# Altium schematic sheet ESP8266.SchDoc
size A3; Author: Bao Thuan; Organization: BACH-KHOA-DK
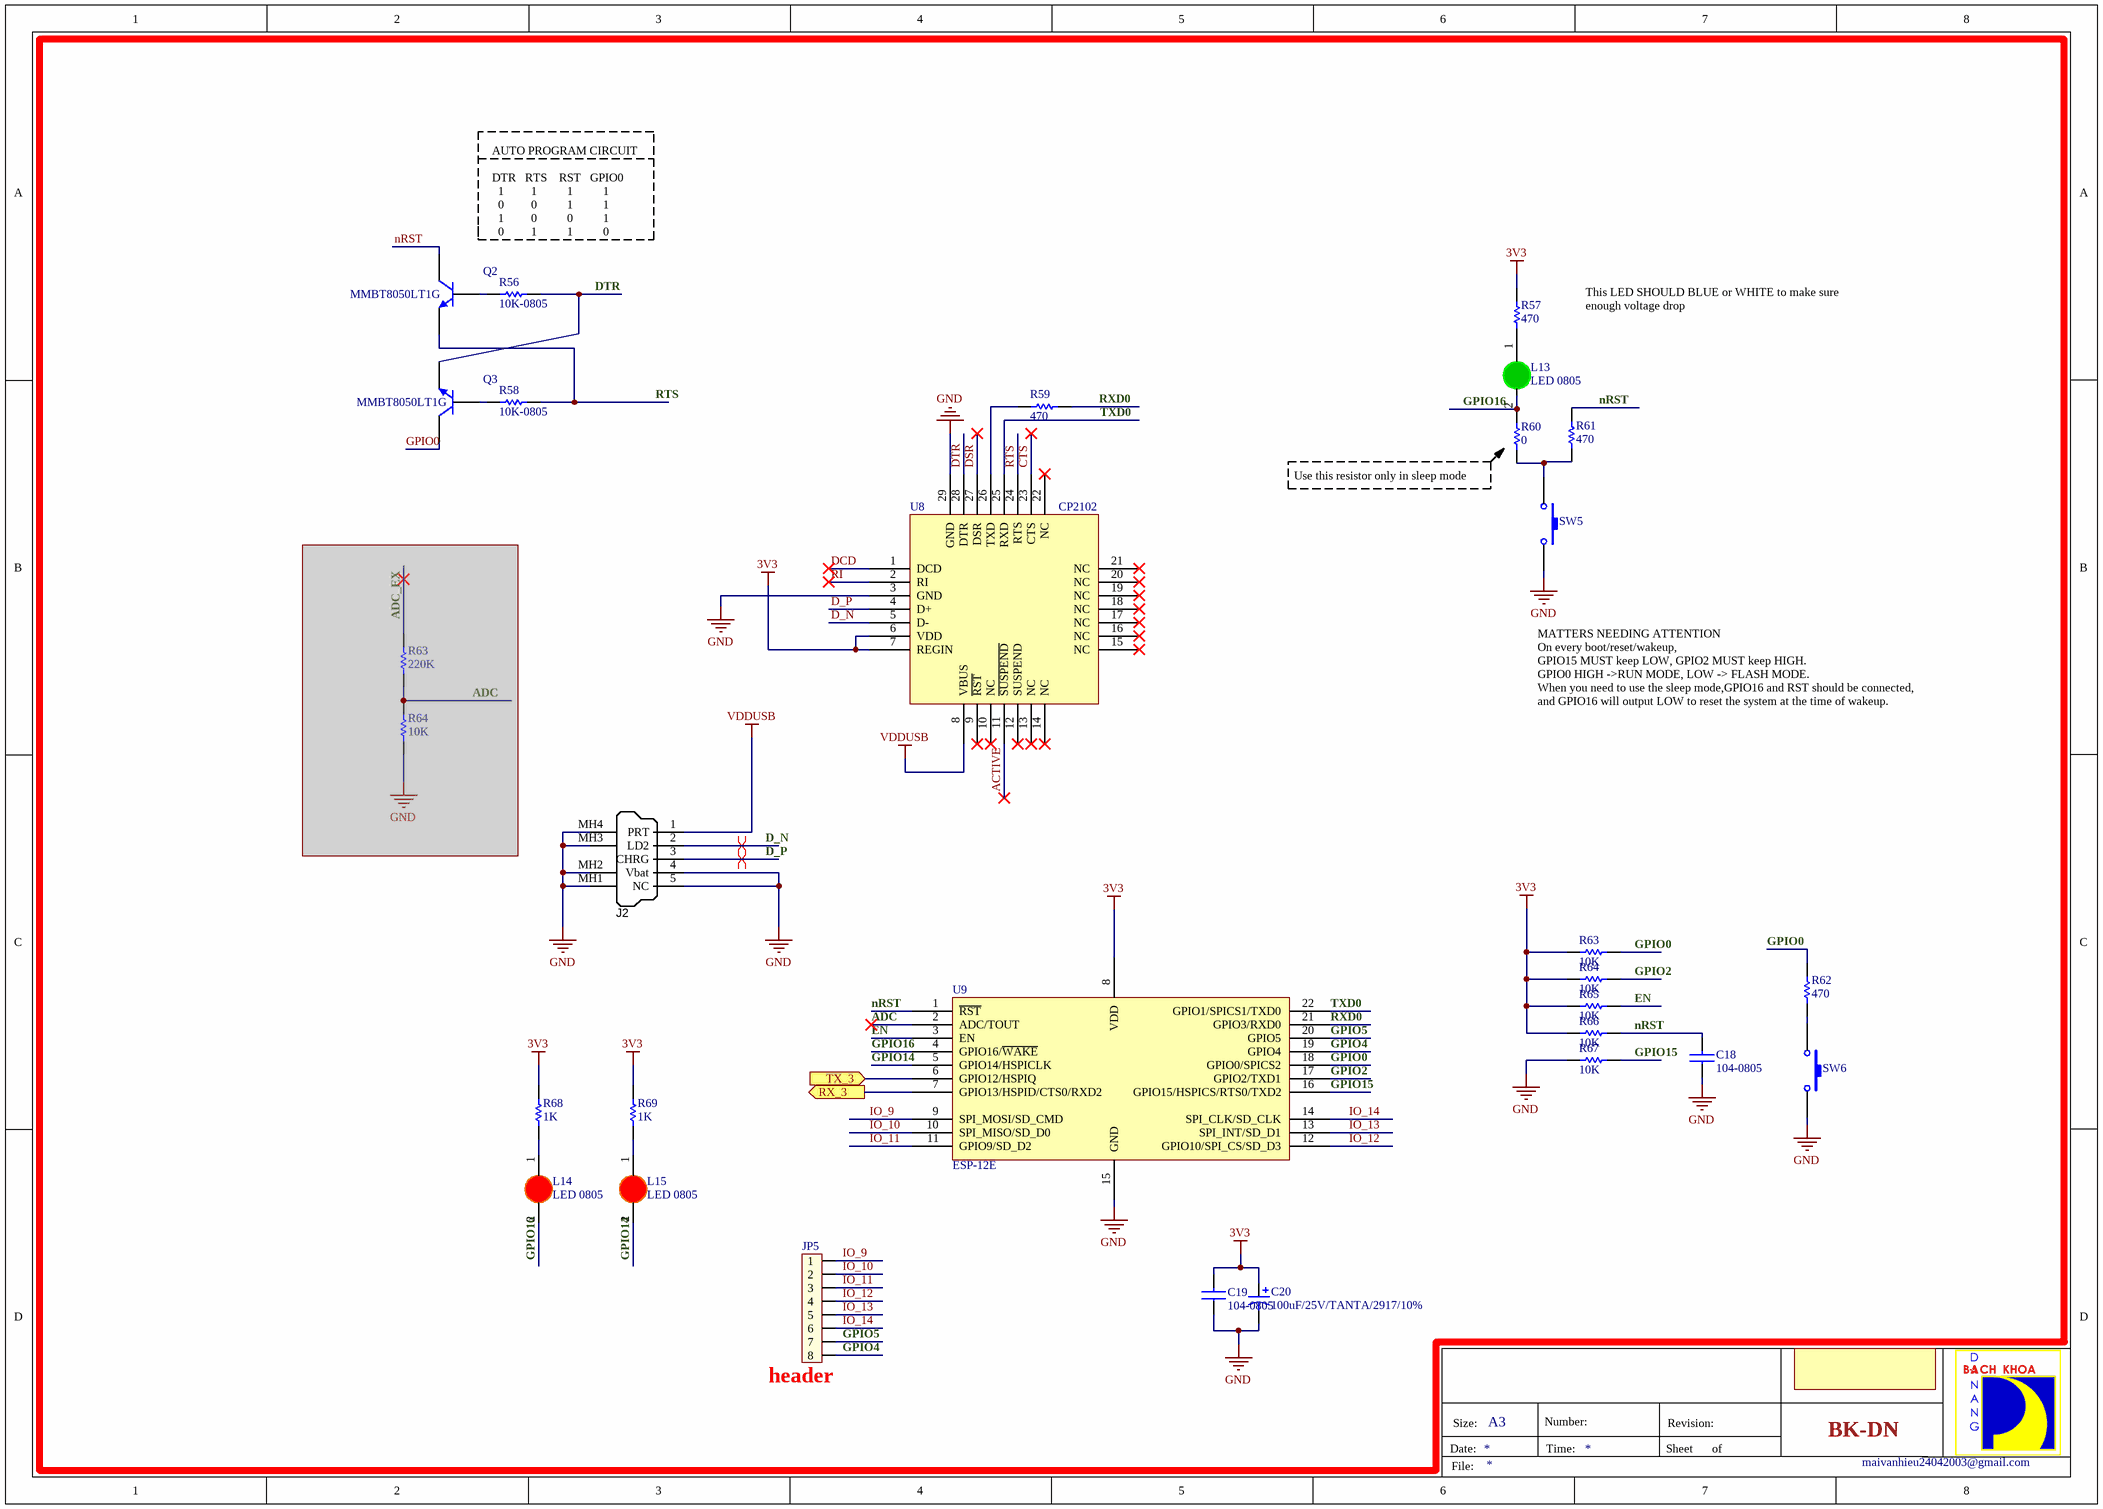
[diagram p0: ESP8266.SchDoc]

## Parts
(Parts that share a designator on the sheet are numbered #1, #2 ... from top to bottom, then left to right.)
C18  104-0805  [CAP0805]
C19  104-0805  [CAP0805]
C20  100uF/25V/TANTA/2917/10%  [CAP TANT CASE X SMD]
J2  USB_Mini-B  [USB_Mini-B_Molex_SMT]  (value not drawn)
JP5  header  [JP8]
L13  LED 0805  [LED-GREEN-0805]
L14  LED 0805  [LED-RED-0805]
L15  LED 0805  [LED-RED-0805]
Q2  MMBT8050LT1G  [SOT23]
Q3  MMBT8050LT1G  [SOT23]
R56  value 10K-0805  [RESC2012L]  (hidden comment: Resistor)
R57  value 470  [RESC2012L]  (hidden comment: Resistor)
R58  value 10K-0805  [RESC2012L]  (hidden comment: Resistor)
R59  value 470  [RESC2012L]  (hidden comment: Resistor)
R60  value 0  [RESC2012L]  (hidden comment: Resistor)
R61  value 470  [RESC2012L]  (hidden comment: Resistor)
R62  value 470  [RESC2012L]  (hidden comment: Resistor)
R63#1  value 220K  [RESC2012L]  (hidden comment: Resistor)  (masked out: inside a compile mask, not in the netlist)
R63#2  value 10K  [RESC2012L]  (hidden comment: Resistor)
R64#1  value 10K  [RESC2012L]  (hidden comment: Resistor)  (masked out: inside a compile mask, not in the netlist)
R64#2  value 10K  [RESC2012L]  (hidden comment: Resistor)
R65  value 10K  [RESC2012L]  (hidden comment: Resistor)
R66  value 10K  [RESC2012L]  (hidden comment: Resistor)
R67  value 10K  [RESC2012L]  (hidden comment: Resistor)
R68  value 1K  [RESC2012L]  (hidden comment: Resistor)
R69  value 1K  [RESC2012L]  (hidden comment: Resistor)
SW5  RS-282G05A3-SM RT  [SW_RS-282G05A3-SM RT]  (value not drawn)
SW6  RS-282G05A3-SM RT  [SW_RS-282G05A3-SM RT]  (value not drawn)
U8  CP2102  [CP2102]
U9  ESP-12E  [ESP-12E]

## Ports
RX_3 (out), TX_3 (in)

## Nets
3V3: C19.2 C20.1 R57.2 R63#2.1 R64#2.1 R65.1 R66.1 R68.2 R69.2 U8.6(VDD) U8.7(REGIN) U9.8(VDD)
GND: C18.1 C19.1 C20.2 J2.4(Vbat) J2.5(NC) J2.MH1(Shell) J2.MH2(Shell) J2.MH3(Shell) J2.MH4(Shell) R67.1 SW5.1 SW6.1 U8.3(GND) U8.29(GND) U9.15(GND)
VDDUSB: J2.1(PRT) U8.8(VBUS)
ACTIVE: U8.11(~{SUSPEND})
ADC: U9.2(ADC/TOUT)
CTS: U8.23(CTS)
D_N: J2.2(LD2) U8.5(D-)
D_P: J2.3(CHRG) U8.4(D+)
DCD: U8.1(DCD)
DSR: U8.27(DSR)
DTR: Q3.2(E) R56.2 U8.28(DTR)
EN: R65.2 U9.3(EN)
GPIO0: Q3.3(C) R62.2 R63#2.2 U9.18(GPIO0/SPICS2)
GPIO2: R64#2.2 U9.17(GPIO2/TXD1)
GPIO4: JP5.8 U9.19(GPIO4)
GPIO5: JP5.7 U9.20(GPIO5)
GPIO14: L15.2(K) U9.5(GPIO14/HSPICLK)
GPIO15: R67.2 U9.16(GPIO15/HSPICS/RTS0/TXD2)
GPIO16: L13.2(K) L14.2(K) R60.2 U9.4(GPIO16/~{WAKE})
IO_9: JP5.1 U9.9(SPI_MOSI/SD_CMD)
IO_10: JP5.2 U9.10(SPI_MISO/SD_D0)
IO_11: JP5.3 U9.11(GPIO9/SD_D2)
IO_12: JP5.4 U9.12(GPIO10/SPI_CS/SD_D3)
IO_13: JP5.5 U9.13(SPI_INT/SD_D1)
IO_14: JP5.6 U9.14(SPI_CLK/SD_CLK)
nRST: C18.2 Q2.3(C) R61.2 R66.2 U9.1(~{RST})
RI: U8.2(RI)
RTS: Q2.2(E) R58.2 U8.24(RTS)
RX_3: U9.7(GPIO13/HSPID/CTS0/RXD2) ; port RX_3
RXD0: R59.2 U9.21(GPIO3/RXD0)
TX_3: U9.6(GPIO12/HSPIQ) ; port TX_3
TXD0: U8.25(RXD) U9.22(GPIO1/SPICS1/TXD0)
NetL13_1: L13.1(A) R57.1
NetL14_1: L14.1(A) R68.1
NetL15_1: L15.1(A) R69.1
NetQ2_1: Q2.1(B) R56.1
NetQ3_1: Q3.1(B) R58.1
NetR59_1: R59.1 U8.26(TXD)
NetR60_1: R60.1 R61.1 SW5.2
NetR62_1: R62.1 SW6.2

Not connected (* = marked no-connect by the designer): U8 9(~{RST})* 10(NC)* 12(SUSPEND)* 13(NC)* 14(NC)* 15(NC)* 16(NC)* 17(NC)* 18(NC)* 19(NC)* 20(NC)* 21(NC)* 22(NC)*

## Layout directives
differential pair: D_N, D_P

## Notes on the sheet
- AUTO PROGRAM CIRCUIT
  DTR   RTS    RST   GPIO0
  1         1          1          1
  0         0          1          1
  1         0          0          1
  0         1          1          0
- This LED SHOULD BLUE or WHITE to make sure enough voltage drop
- Use this resistor only in sleep mode
- MATTERS NEEDING ATTENTION
  On every boot/reset/wakeup,
  GPIO15 MUST keep LOW, GPIO2 MUST keep HIGH.
  GPIO0 HIGH ->RUN MODE, LOW -> FLASH MODE.
  When you need to use the sleep mode,GPIO16 and RST should be connected,
  and GPIO16 will output LOW to reset the system at the time of wakeup.
- Van Hieu
- Date:
- Size:
- A3
- Number:
- Time:
- Sheet
- Revision:
- of
- BK-DN
- File:
- maivanhieu24042003@gmail.com

## Library data of the parts
C18 C19 = CC0805JRNPO9BN200: Multilayer Ceramic Capacitors MLCC - SMD/SMT 20pF 50V NPO 5%; Manufacturer: Yageo; Type: General Purpose Surface-Mount Ceramic Multilayer Capacitor; Voltage Rating DC: 50 VDC; Class: Class 1; Dielectric: C0G (NP0); Supplier 1: Mouser; Manufacturer Part Number: CC0805JRNPO9BN200; RoHS: RoHS Compliant By Exemption; Category: Multilayer Ceramic Capacitors MLCC - SMD/SMT; Stock 1: 0; Pricing 1: 1=0.100, 10=0.040, 100=0.018, 1000=0.014, 4000=0.013 (USD); Capacitance: 20 pF; Length: 2 mm; Package / Case: 0805 (2012 metric); Packaging: Cut Tape; Product: General Type MLCCs; Series: CC; Termination Style: SMD/SMT; Tolerance: 5 %; Width: 1.25 mm; Brand: Yageo; Case Code - in: 0805; Case Code - mm: 2012; Maximum Operating Temperature: + 125 C; Minimum Operating Temperature: - 55 C; Product Type: Ceramic Capacitors; Standard Pack Qty: 4000; Subcategory: Capacitors; Termination: Standard; RoHS - Mouser: E; Minimum Order Quantity: 1; Reeling: True; ComponentLink1URL: http://www.mouser.com/datasheet/2/447/UPY-GP_NP0_16V-to-50V_16-1109089.pdf; ComponentLink1Description: http://www.mouser.com/datasheet/2/447/UPY-GP_NP0_16V-to-50V_16-1109089.pdf; Supplier Part Number 1: 603-CC805JRNPO9BN200
C20 = 100uF/6.3V/SIZE B/20%: CAP TANT 100UF 6.3V 20% 1411; Manufacturer: Kemet; Manufacturer Part Number: T491B107M006AT; Manufacturer Size Code: B; Capacitance: 100µF; ESR (Equivalent Series Resistance): 3 Ohm; Type: Molded; Lifetime @ Temp.: 2000 Hrs @ 85°C; RoHS: RoHS Compliant; Category: Capacitors; Packaging: Cut Tape (CT); Tolerance: ±20%; Voltage - Rated: 6.3V; Operating Temperature: -55°C ~ 125°C; Mounting Type: Surface Mount; Package / Case: 1411 (3528 Metric); Size / Dimension: 0.138" L x 0.110" W (3.50mm x 2.80mm); Height - Seated (Max): 0.083" (2.10mm); Lead Spacing: -; Features: General Purpose; ComponentLink1URL: http://www.kemet.com/Lists/ProductCatalog/Attachments/254/KEM_T2005_T491.pdf; ComponentLink1Description: http://www.kemet.com/Lists/ProductCatalog/Attachments/254/KEM_T2005_T491.pdf; Supplier 1: Digi-Key; Supplier Part Number 1: 399-3710-1-ND
J2 = USB_Mini-B: Connector SMD USB Type Mini-B; Manufacturer 1: Molex Connector Corporation; Manufacturer Part Number 1: 67503-1020; SCDType: undef; Package / Case: SMD; Supplier 1: Digi-Key; Supplier Part Number 1: WM5461CT-ND
JP5 = JP8: JP8 PIN; Value: JP7
L13 = LED GREEN 0805: SMD; Don_Vi: Con; Chung_Loai: Dán; Ma_Hang: MH000897; Ten_Linh_Kien: LED 0805 Màu Đỏ (Red); Ghi_Chu: *; Kieu_Chan: *
L14 L15 = LED RED 0805: SMD; Don_Vi: Con; Chung_Loai: Dán; Ma_Hang: MH000897; Ten_Linh_Kien: LED 0805 Màu Đỏ (Red); Ghi_Chu: *; Kieu_Chan: *
Q2 Q3 = MMBT8050LT1G_SMD: NPN General Purpose Amplifier; Published: 8-Jun-2000; LatestRevisionDate: 15-Jan-2003; LatestRevisionNote: PCB Footprint 'BCY-W3/D4.7' replaced; DatasheetVersion: 1997; PackageVersion: Sep-1998; PackageReference: TO-92A; Publisher: Altium Limited; Code_JEDEC: TO-92A; ComponentLink1Description: Manufacturer Link; ComponentLink1URL: http://www.fairchildsemi.com/; ComponentLink2Description: Datasheet; ComponentLink2URL: http://www.fairchildsemi.com/ds/2N%2F2N3904.pdf
R56-R62 R63#1 R63#2 R64#1 R64#2 R65-R69 = Resistor: Semiconductor Resistor; Published: 8-Jun-2000; LatestRevisionDate: 17-Jul-2002; LatestRevisionNote: Re-released for DXP Platform.; PackageReference: AXIAL-0.5; Publisher: Altium Limited
SW5 SW6 = SW_RS-282G05A3-SM RT: SWITCH TACTILE SPST-NO 0.05A 12V; Manufacturer: C&K; Switch Function: Off-Mom; Contact Rating @ Voltage: 0.05A @ 12VDC; Actuator Type: Rectangular Button; Actuator Height off PCB, Vertical: 2.50mm; Actuator Orientation: Top Actuated; Outline: 6.00mm x 3.60mm; Illumination: Non-Illuminated; Operating Force: 250gf; Actuator Material: Polyamide (PA), Nylon; Switch Travel: 0.25mm; Mechanical Life: 50,000 Cycles; Supplier 1: Digi-Key; Manufacturer Part Number: RS-282G05A3-SM RT; RoHS: RoHS Compliant; Category: Switches; Stock 1: 34459; Pricing 1: 1=0.81, 10=0.78, 25=0.7356, 50=0.6474, 100=0.5885, 250=0.55908, 500=0.54436, 1000=0.42666 (USD); Packaging: Digi-Reel®; Part Status: Active; Circuit: SPST-NO; Mounting Type: Surface Mount; Actuator Length, Right Angle: -; Termination Style: Gull Wing; Illumination Type, Color: -; Illumination Voltage (Nominal): -; Ingress Protection: -; Features: -; Operating Temperature: -; ComponentLink1URL: http://media.digikey.com/pdf/Data%20Sheets/C&K/RS-282G05A-SM_RT.pdf; ComponentLink1Description: http://media.digikey.com/pdf/Data%20Sheets/C&K/RS-282G05A-SM_RT.pdf; Supplier Part Number 1: CKN10384DKR-ND
U9 = ESP_12_E: ESP8266 ESP-12E Module (ESP8266, Castellated Holes); IC: ESP8266-EX; Vendor: Ai-thinker